# EAGLE design Mainsnode_v2_wifi_rev_a (EAGLE 6.3)
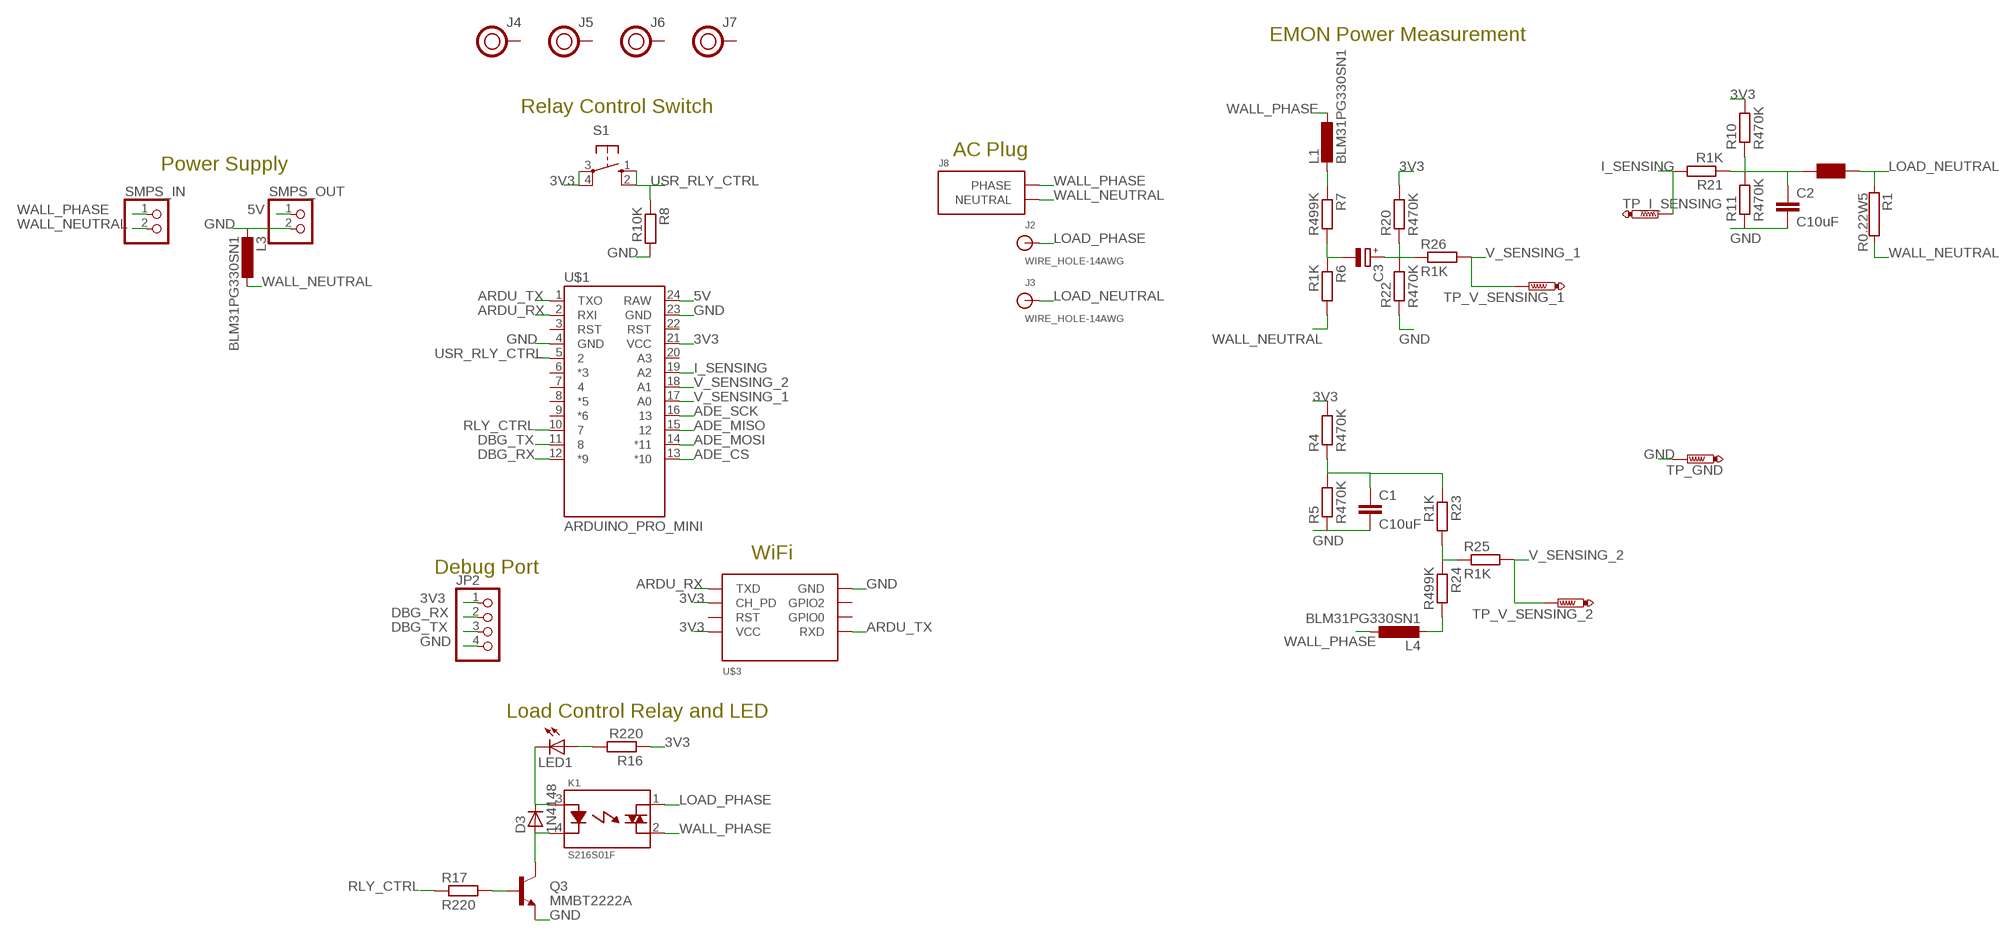
[diagram p0: schematic, sheet 1]

## Parts
C1  C10uF  C-EUC0805  [C0805]
C2  C10uF  C-EUC0805  [C0805]
C3  CPOL-EU140CLH-0810  [140CLH-0810]
D3  1N4148  D-SOD-80  [SOD80]
J2  WIRE_HOLE-14AWG  [WIRE_HOLE-14AWG]
J3  WIRE_HOLE-14AWG  [WIRE_HOLE-14AWG]
J4  HOLE  [HOLE-0.125]
J5  HOLE  [HOLE-0.125]
J6  HOLE  [HOLE-0.125]
J7  HOLE  [HOLE-0.125]
J8  AC-PLUG-2  [AC_MALE_PINS_2]
JP2  PINHD-1X4  [1X04]
K1  S216S01F  [RELAY_SX16S0X]
L1  BLM31PG330SN1  L-EUL3216C  [L3216C]
L3  BLM31PG330SN1  L-EUL3216C  [L3216C]
L4  BLM31PG330SN1  L-EUL3216C  [L3216C]
LED1  LED3MM  [LED3MM]
Q3  MMBT2222A  TRANSISTOR_NPNMMBT2222A  [SOT23-3]
R1  R0.22W5  RKH206-8  [KH206-8]
R4  R470K  R-EU_R0805  [R0805]
R5  R470K  R-EU_R0805  [R0805]
R6  R1K  R-EU_R0805  [R0805]
R7  R499K  R-EU_R0805  [R0805]
R8  R10K  R-EU_R0805  [R0805]
R10  R470K  R-EU_R0805  [R0805]
R11  R470K  R-EU_R0805  [R0805]
R16  R220  R-EU_R0805  [R0805]
R17  R220  R-EU_R0805  [R0805]
R20  R470K  R-EU_R0805  [R0805]
R21  R1K  R-EU_R0805  [R0805]
R22  R470K  R-EU_R0805  [R0805]
R23  R1K  R-EU_R0805  [R0805]
R24  R499K  R-EU_R0805  [R0805]
R25  R1K  R-EU_R0805  [R0805]
R26  R1K  R-EU_R0805  [R0805]
S1  10-XX  [B3F-10XX]
SMPS_IN  PINHD-1X2  [1X02]
SMPS_OUT  PINHD-1X2  [1X02]
TP_GND  PTR1PAD1-13  [P1-13]
TP_I_SENSING  PTR1PAD1-13  [P1-13]
TP_V_SENSING_1  PTR1PAD1-13  [P1-13]
TP_V_SENSING_2  PTR1PAD1-13  [P1-13]
U$1  ARDUINO_PRO_MINI  [ARDUINO_PRO_MINI]
U$2  BLM18BB151SN1  L0603  [L0603]
U$3  ESP8266  [ESP8266]

## Nets
3V3: JP2.1 R4.2 R10.2 R16.1 R20.2 S1.3(P) S1.4(P1) U$1.21(VCC) U$3.CH_PD U$3.VCC
5V: SMPS_OUT.1 U$1.24(RAW)
ADE_CS: U$1.13(*10)
ADE_MISO: U$1.15
ADE_MOSI: U$1.14(*11)
ADE_SCK: U$1.16
ARDU_RX: U$1.2(RXI) U$3.TXD
ARDU_TX: U$1.1(TXO) U$3.RXD
DBG_RX: JP2.2 U$1.12(*9)
DBG_TX: JP2.3 U$1.11
GND: C1.2 C2.2 JP2.4 L3.2 Q3.2(E) R5.1 R8.2 R11.1 R22.1 SMPS_OUT.2 TP_GND.TP U$1.4(GND) U$1.23(GND) U$3.GND
I_SENSING: R21.2 TP_I_SENSING.TP U$1.19(A2)
LOAD_NEUTRAL: J3.P$1 R1.1 U$2.2
LOAD_PHASE: J2.P$1 K1.1
N$1: C3.- R6.1 R7.2
N$2: C3.+ R20.1 R22.2 R26.1
N$3: C2.1 R10.1 R11.2 R21.1 U$2.1
N$4: C1.1 R4.1 R5.2 R23.1
N$5: L1.2 R7.1
N$6: R23.2 R24.1 R25.1
N$8: LED1.A R16.2
N$13: L4.2 R24.2
N$16: D3.1(C) K1.3 LED1.K(C)
N$18: D3.2(A) K1.4 Q3.3(C)
N$19: Q3.1(B) R17.2
RLY_CTRL: R17.1 U$1.10
USR_RLY_CTRL: R8.1 S1.1(S) S1.2(S1) U$1.5
V_SENSING_1: R26.2 TP_V_SENSING_1.TP U$1.17(A0)
V_SENSING_2: R25.2 TP_V_SENSING_2.TP U$1.18(A1)
WALL_NEUTRAL: J8.WALL_NEUTRAL(NEUTRAL) L3.1 R1.2 R6.2 SMPS_IN.2
WALL_PHASE: J8.WALL_PHASE(PHASE) K1.2 L1.1 L4.1 SMPS_IN.1
Unconnected: J4.1 J5.1 J6.1 J7.1 U$1.3(RST) U$1.6(*3) U$1.7 U$1.8(*5) U$1.9(*6) U$1.20(A3) U$1.22(RST) U$3.GPIO0 U$3.GPIO2 U$3.RST

## Notes on the sheet
- EMON Power Measurement
- Relay Control Switch
- AC Plug
- Power Supply
- WiFi
- Debug Port
- Load Control Relay and LED

## Library data of the parts
C1 C2 = resistor:C-EU: CAPACITOR, European symbol
C3 = resistor:CPOL-EU: POLARIZED CAPACITOR, European symbol
D3 = semicon-smd-ipc:D-: DIODE unfilled
J2 J3 = powercube:WIRE_HOLE-14AWG: Solder point for 14AWG wire
J4-J7 = powercube:HOLE: 0.125" PCB Hole with ring
J8 = tigorcustom:AC-PLUG-2: For use with Bud Industries Box: 377-1709-ND
JP2 = pinhead:PINHD-1X4: PIN HEADER
K1 = powercube:S216S01F: RELAY SSR 240VAC 16A TRIAC 4-SIP; DIGIKEY: 425-2413-5-ND; MOUSER: 852-S216S01F; NEWARK: 14N9591
L1 L3 L4 = resistor:L-EU: INDUCTOR, European symbol
LED1 = adafruit:LED: LED OSRAM: - CHIPLED LG R971, LG N971, LY N971, LG Q971, LY Q971, LO R971, LY R971 LH N974, LH R974 LS Q976, LO Q976, LY Q976 LO Q996 - Hyper CHIPLED LW Q18S LB Q993, LB Q99A, LB R99A - SideLED LS A670, LO A670, LY A670, LG A670, LP A670 LB A673, LV A673, LT A673, LW A673 LH A674 LY A675 LS A676, LA A676, LO A676, LY A676, LW A676 LS A679, LY A679, LG A679 - Hyper Micro SIDELED® LS Y876, LA Y876, LO Y876, LY Y876 LT Y87S - SmartLED LW L88C, LW L88S LB L89C, LB L89S, LG L890 LS L89K, LO L89K, LY L89K LS L896, LA L896, LO L896, LY L896 - TOPLED LS T670, LO T670, LY T670, LG T670, LP T670 LSG T670, LSP T670, LSY T670, LOP T670, LYG T670 LG T671, LOG T671, LSG T671 LB T673, LV T673, LT T673, LW T673 LH T674 LS T676, LA T676, LO T676, LY T676, LB T676, LH T676, LSB T676, LW T676 LB T67C, LV T67C, LT T67C, LS T67K, LO T67K, LY T67K, LW E67C LS E67B, LA E67B, LO E67B, LY E67B, LB E67C, LV E67C, LT E67C LW T67C LS T679, LY T679, LG T679 LS T770, LO T770, LY T770, LG T770, LP T770 LB T773, LV T773, LT T773, LW T773 LH T774 LS E675, LA E675, LY E675, LS T675 LS T776, LA T776, LO T776, LY T776, LB T776 LHGB T686 LT T68C, LB T68C - Hyper Mini TOPLED® LB M676 - Mini TOPLED Santana® LG M470 LS M47K, LO M47K, LY M47K Source: http://www.osram.convergy.de/
Q3 = SparkFun-DiscreteSemi:TRANSISTOR_NPN: Generic NPN BJT MMBT2222A - TRANS-08049 (SOT-23, 1A 40V) MPSA42 - TRANS-09116 (SOT-23, 500mA 300V) MMBT5088LT1G - TRANS-11160 (SOT-23, 50 mA 30V) BC547 - COM-08928 <http://www.sparkfun.com/products/8928> (TO-92 45V 100mA) (1.Collector 2.Base 3.Emitter) 2N3904 - COM-00521 <http://www.sparkfun.com/products/521> (TO-92 40V 200mA) (1.Emitter 2.Base 3.Collector) P2N2222A - COM-12852 <http://www.sparkfun.com/products/12852> (TO-92 40V 600mA) (1.Collector 2.Base 3.Emitter); PROD_ID: TRANS-08049
R1 = resistor-power:R: Power Resitor; OC_FARNELL: unknown; OC_NEWARK: unknown
R4-R8 R10 R11 R16 R17 R20-R26 = resistor:R-EU_: RESISTOR, European symbol
S1 = switch-omron:10-XX: OMRON SWITCH; MPN: B3F-1000; OC_FARNELL: 176432; OC_NEWARK: 36M3542
SMPS_IN SMPS_OUT = pinhead:PINHD-1X2: PIN HEADER
TP_GND TP_I_SENSING TP_V_SENSING_1 TP_V_SENSING_2 = testpad:PTR1: TEST PIN
U$1 = tigorcustom:ARDUINO_PRO_MINI
U$2 = tigorcustom:L0603
U$3 = tigorcustom:ESP8266

## Board
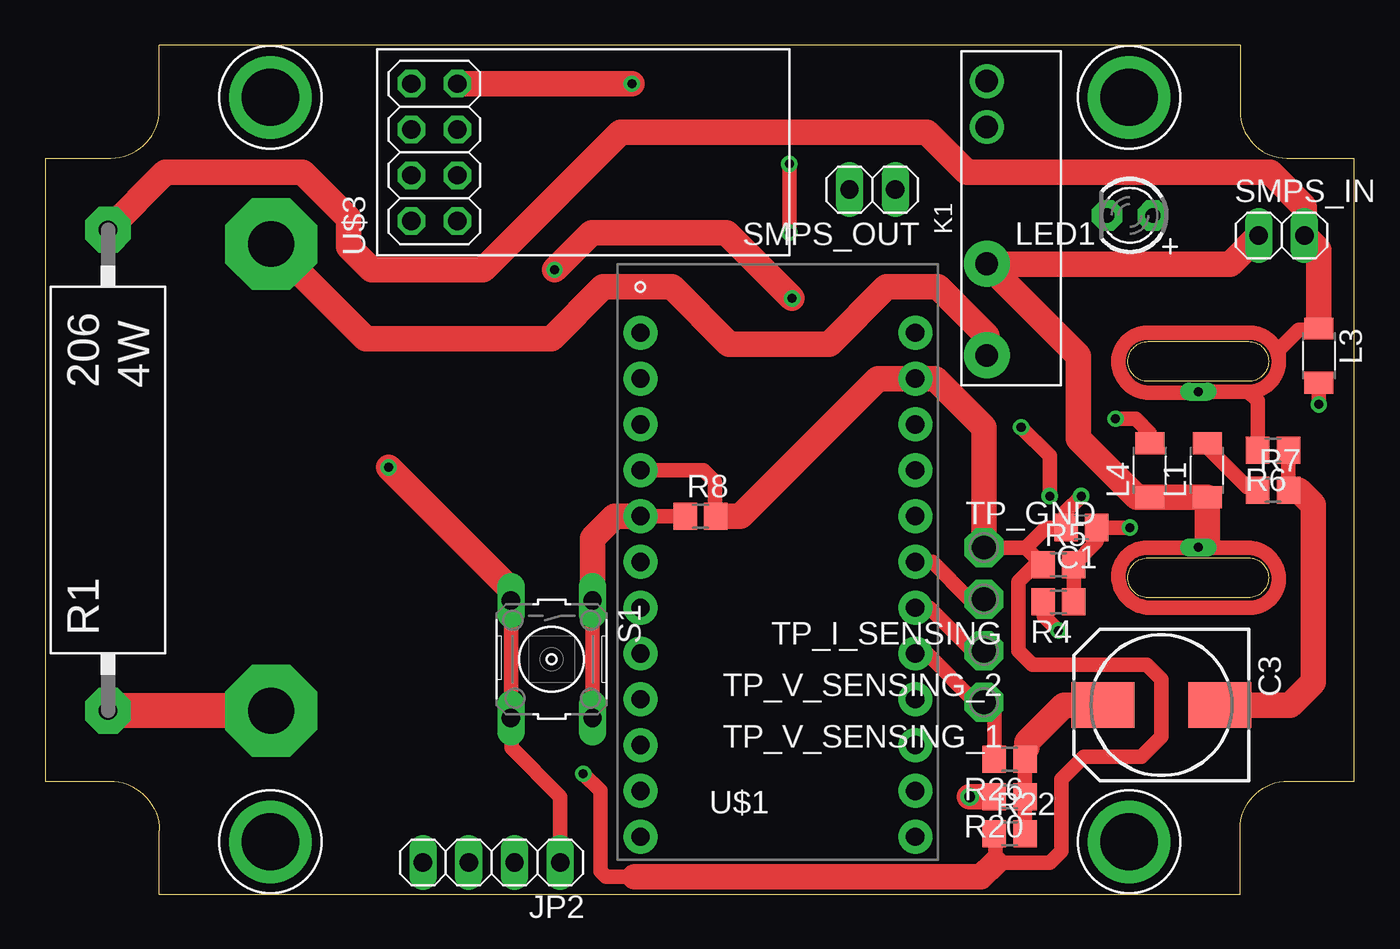
[diagram p1: board, top side]
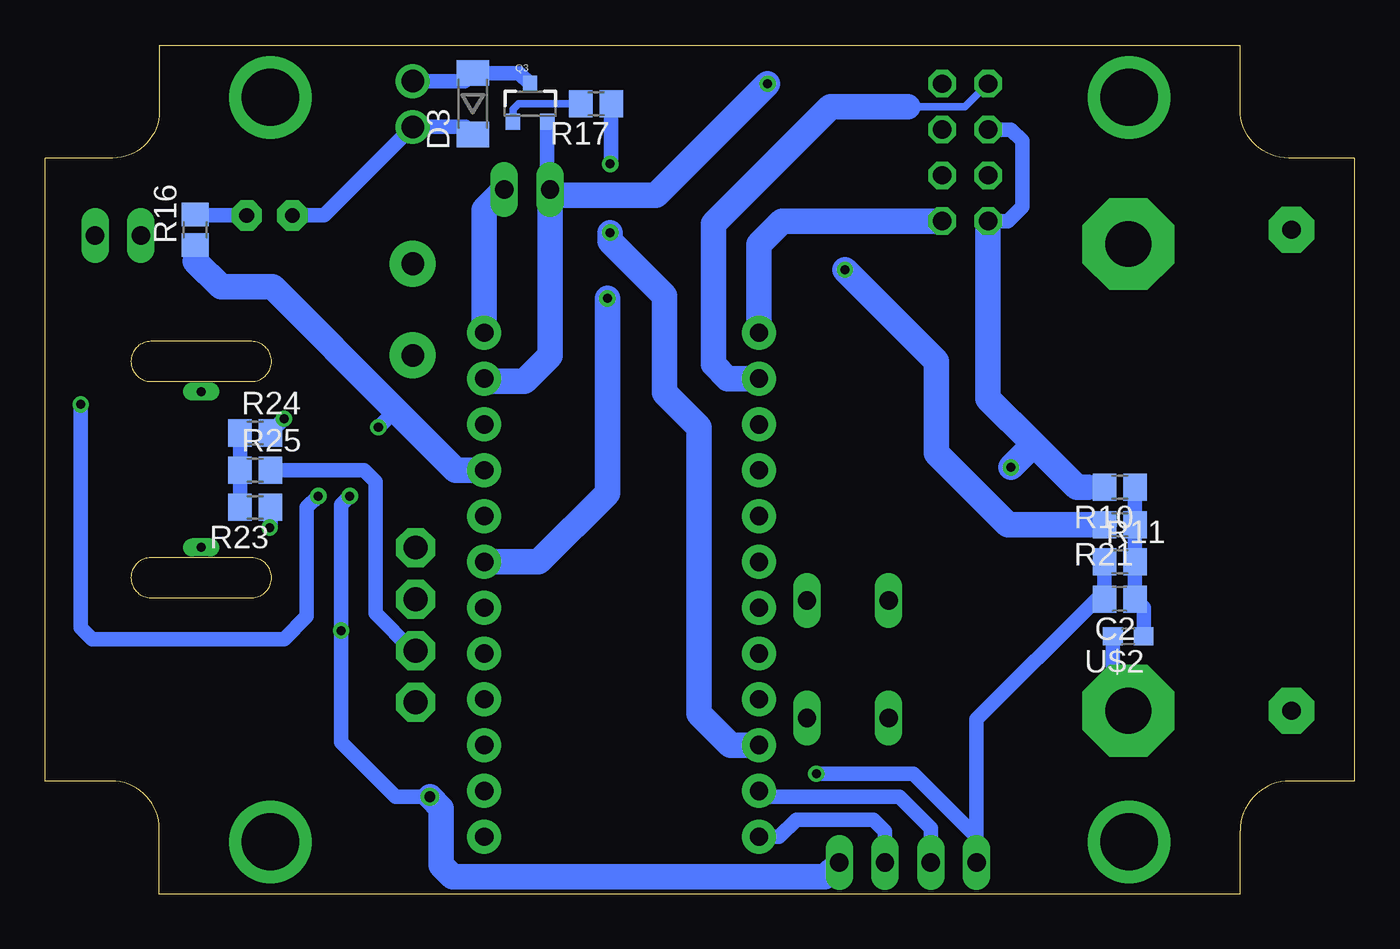
[diagram p2: board, bottom side, seen from below]

Size 72.62 x 47.07 mm. Coordinates in mm from the lower left corner, seen from the top.
Outline: 6.34,0 66.28,0 66.28,3.6 arc-90 68.94,6.26 72.62,6.26 72.62,40.8 68.87,40.8 arc-90 66.28,43.39 66.28,47.07 6.34,47.07 6.34,43.49 arc-90 3.65,40.8 0,40.8 0,6.26 3.58,6.26 arc-90 6.34,3.51 6.34,0
Copper layers (1*16): Top 0.035mm / dielectric 1.5mm / Bottom 0.035mm
Design rules "default": minimum track width 10mil, minimum drill 24mil, track to track 8mil, track to pad 8mil, pad to pad 8mil, via to via 8mil, smd to smd 8mil, copper to edge 40mil, drill to drill 8mil, minimum pad ring 10mil, minimum via ring 8mil, stop-mask expansion 4mil, vias tented up to drill 0mil, thermal gap 10mil

### Footprints (pad centres in the part's own frame; a part is rotated, then mirrored left to right if it is on the bottom)
C0805 = smd 1.3 x 1.5: 1 -0.85,0; 2 0.85,0
140CLH-0810 = smd 3.5 x 2.5: + 3.25,0; - -3.25,0
SOD80 = smd 1.4 x 1.8: 1 -1.7,0; 2 1.7,0
WIRE_HOLE-14AWG = drill 2.54 pad 5.08 octagon: P$1 0,0
HOLE-0.125 = drill 3.175 pad 4.572: 1 0,0
AC_MALE_PINS_2 = drill 0.5 pad 0.813 long: WALL_NEUTRAL 0,-4.318; WALL_PHASE 0,4.318
1X04 = drill 1.016 long: 1 -3.81,0; 2 -1.27,0; 3 1.27,0; 4 3.81,0
RELAY_SX16S0X = drill 1.25 pad 2.54: 1 -7.602,0; 2 -2.522,0 | drill 1.25: 3 5.062,0; 4 7.602,0
L3216C = smd 1.2 x 1.6: 1 -1.5,0; 2 1.5,0
LED3MM = drill 0.813 pad 1.676 octagon: A -1.27,0; K 1.27,0
SOT23-3 = smd 0.8 x 0.9: 1 -0.95,-1; 2 0.95,-1; 3 0,1.1
KH206-8 = drill 1.016 pad 2.54 octagon: 1 -13.335,0; 2 13.335,0
R0805 = smd 1.3 x 1.5: 1 -0.85,0; 2 0.85,0
B3F-10XX = drill 1.016 long: 1 -3.251,2.261; 2 3.251,2.261; 3 -3.251,-2.261; 4 3.251,-2.261
1X02 = drill 1.016 long: 1 -1.27,0; 2 1.27,0
P1-13 = drill 1.321 pad 2.159 octagon: TP 0,0
ARDUINO_PRO_MINI = drill 1.016 pad 1.88: 1 -7.62,12.7; 2 -7.62,10.16; 3 -7.62,7.62; 4 -7.62,5.08; 5 -7.62,2.54; 6 -7.62,0; 7 -7.62,-2.54; 8 -7.62,-5.08; 9 -7.62,-7.62; 10 -7.62,-10.16; 11 -7.62,-12.7; 12 -7.62,-15.24; 13 7.62,-15.24; 14 7.62,-12.7; 15 7.62,-10.16; 16 7.62,-7.62; 17 7.62,-5.08; 18 7.62,-2.54; 19 7.62,0; 20 7.62,2.54; 21 7.62,5.08; 22 7.62,7.62; 23 7.62,10.16; 24 7.62,12.7
L0603 = smd 1.1 x 1: 1 -0.85,0; 2 0.85,0
ESP8266 = drill 1.016 octagon: CH_PD 1.27,1.27; GND 3.81,-1.27; GPIO0 -1.27,-1.27; GPIO2 1.27,-1.27; RST -1.27,1.27; RXD -3.81,-1.27; TXD 3.81,1.27; VCC -3.81,1.27

### Placement (x,y rotation side)
C1  57.47,20.32 180 top
C2  13.02,16.35 180 bottom
C3  61.91,10.48 180 top
D3  48.9,43.81 90 bottom
J2  12.54,36.04 0 top
J3  12.54,10.16 0 top
J4  12.5,44.17 0 top
J5  60.12,44.17 0 top
J6  12.5,2.9 0 top
J7  60.12,2.9 0 top
J8  63.96,23.53 180 top
JP2  24.77,1.75 180 top
K1  52.23,37.47 90 top
L1  64.45,23.5 90 top
L3  70.64,29.84 270 top
L4  61.28,23.5 90 top
LED1  60.17,37.62 180 top
Q3  45.72,43.81 0 bottom
R1  3.49,23.5 90 top
R4  56.2,16.19 180 top
R5  56.2,18.26 0 top
R6  68.1,24.61 180 top
R7  68.1,22.38 0 top
R8  36.35,20.95 0 top
R10  13.02,22.54 180 bottom
R11  13.02,18.41 0 bottom
R16  64.29,36.83 90 bottom
R17  42.07,43.81 180 bottom
R20  53.5,5.4 180 top
R21  13.02,20.48 180 bottom
R22  53.5,3.33 0 top
R23  60.96,21.43 180 bottom
R24  60.96,25.56 0 bottom
R25  60.96,23.5 0 bottom
R26  53.5,7.46 180 top
S1  28.1,13.02 270 top
SMPS_IN  68.58,36.51 0 top
SMPS_OUT  45.88,39.05 180 top
TP_GND  52.07,19.21 0 top
TP_I_SENSING  52.07,16.35 180 top
TP_V_SENSING_1  52.07,10.64 180 top
TP_V_SENSING_2  52.07,13.49 180 top
U$1  40.64,18.41 0 top
U$2  12.54,14.29 180 bottom
U$3  21.59,41.12 90 top

### Tracks (layer width: path | path; a pad name or v marks a point on that pad's centre or on a via)
3V3  (via drill 0.5, 0.6)
  Top 0.813: 52.07,5.4 R20.2 | v55.72,22.07 55.72,24.29 v54.13,25.88 | R4.2 55.4,16.14 55.4,15.4 v56.2,14.61 | JP2.1 28.57,5.4 25.88,8.1 25.88,9.73 S1.4 S1.3
  Top 1.422: v51.28,5.4 52.07,5.4 | S1.3 25.84,16.87 v19.05,23.65
  Bottom 0.813: 64.29,35.08 R16.1 | v51.28,5.4 53.18,5.4 56.2,8.41 v56.2,14.61 56.2,21.59 v55.72,22.07 | v54.13,25.88 53.18,26.83 | U$3.CH_PD 19.05,42.39 18.41,41.75 18.41,38.1 19.21,37.31 U$3.VCC | R10.2 14.76,22.54
  Bottom 1.422: JP2.1 29.37,0.95 50.01,0.95 50.64,1.59 50.64,4.76 v51.28,5.4 | U$1.21 49.85,23.5 53.18,26.83 60.01,33.66 62.87,33.66 64.29,35.08 | 14.76,22.54 15.4,22.54 17.78,24.92 | 17.78,24.92 20.32,27.46 U$3.VCC | v19.05,23.65 17.78,24.92
5V
  Bottom 1.422: U$1.24 48.26,37.94 SMPS_OUT.1
ARDU_RX
  Bottom 0.406: U$3.TXD 21.59,43.66 24.77,43.66
  Bottom 1.422: 24.77,43.66 29.05,43.66 35.56,37.15 35.56,29.37 34.77,28.57 U$1.2
ARDU_TX
  Bottom 1.422: U$3.RXD 31.75,37.31 33.02,36.04 U$1.1
DBG_RX
  Bottom 0.813: U$1.12 31.91,3.17 30.96,4.13 26.67,4.13 26.04,3.49 JP2.2
DBG_TX
  Bottom 0.813: JP2.3 23.5,3.65 25.24,5.4 32.7,5.4 U$1.11
GND  (via drill 0.5)
  Top 0.813: TP_GND.TP 54.4,19.21 | 54.4,19.21 R5.1 54.93,18.26 53.98,17.3 53.98,13.49 54.77,12.7 61.12,12.7 61.91,11.91 61.91,8.73 60.8,7.62 57.63,7.62 56.36,6.35 56.36,2.38 55.72,1.75 52.7,1.75 52.7,3.28 R22.1 | 54.4,19.21 55.51,20.32 C1.2 56.62,21.22 v57.47,22.07 | v70.64,27.15 L3.2 | U$1.4 36.51,23.5 37.15,22.86 37.15,21.01 R8.2 37.78,20.95 | v29.84,6.67 30.8,5.71 30.8,1.27 31.11,0.95 32.7,0.95
  Top 1.422: TP_GND.TP 52.07,25.88 49.37,28.57 U$1.23 46.2,28.57 38.58,20.95 37.78,20.95 | 52.7,1.75 51.91,0.95 32.7,0.95 | U$3.GND v32.54,44.93
  Bottom 0.813: Q3.2 44.77,39.21 SMPS_OUT.2 | v70.64,27.15 70.64,14.76 70.01,14.13 59.37,14.13 58.1,15.4 58.1,21.43 v57.47,22.07 | v29.84,6.67 24.45,6.67 20.95,3.17 JP2.4 20.95,9.68 14.29,16.35 C2.2 R11.1
  Bottom 1.422: U$1.23 48.1,28.42 46.04,28.42 44.61,29.84 SMPS_OUT.2 44.29,38.73 38.73,38.73 v32.54,44.93
I_SENSING  (via drill 0.5)
  Top 0.813: U$1.19 49.21,18.41 51.28,16.35 TP_I_SENSING.TP
  Top 1.422: v28.26,34.61 30.32,36.67 37.78,36.67 v41.43,33.02
  Bottom 1.422: R21.2 19.21,20.48 23.18,24.45 23.18,29.53 v28.26,34.61 | v41.43,33.02 41.43,22.23 45.24,18.41 U$1.19
LOAD_NEUTRAL
  Top 1.93: J3.P$1 R1.1
  Bottom 0.813: U$2.2 13.39,11.01 J3.P$1
LOAD_PHASE
  Top 1.422: K1.1 52.23,30.96 49.53,33.66 46.67,33.66 43.5,30.48 37.94,30.48 34.77,33.66 30.96,33.66 28.1,30.8 17.78,30.8 J2.P$1
N$1
  Top 0.813: R6.1 R7.2 69.53,22.38
  Top 1.422: C3.- 69.06,10.48 70.33,11.75 70.33,21.59 69.53,22.38
N$2
  Top 0.813: R22.2 R20.1 R26.1 54.35,7.99 54.45,8.1
  Top 1.422: 54.45,8.1 54.45,8.41 56.52,10.48 C3.+
N$3
  Bottom 0.813: U$2.1 11.69,15.88 C2.1 R11.2 R21.1 R10.1
N$4  (via drill 0.5)
  Top 0.813: R4.1 R5.2 58.32,19.53 C1.1 v60.17,20.32
  Bottom 0.813: R23.1 60.11,20.38 v60.17,20.32
N$5
  Top 0.813: L1.2 64.45,24.77 66.67,22.54 67.09,22.54 R7.1
N$6
  Bottom 0.813: R24.1 R25.1 R23.2
N$8
  Bottom 0.813: LED1.A 64.24,37.62 R16.2
N$13  (via drill 0.5)
  Top 0.813: v59.37,26.35 60.48,26.35 61.28,25.56 L4.2
  Bottom 0.813: R24.2 60.11,25.61 v59.37,26.35
N$16
  Bottom 0.813: LED1.K 57.13,37.62 K1.3 49.31,42.53 D3.1
N$18
  Bottom 0.813: K1.4 49.34,45.07 D3.2 46.32,45.52 Q3.3
N$19
  Bottom 0.406: R17.2 46.35,43.81 46.67,43.5 Q3.1
RLY_CTRL  (via drill 0.5)
  Top 0.813: v41.27,40.48 v41.27,36.67
  Bottom 0.813: R17.1 41.22,40.54 v41.27,40.48
  Bottom 1.422: U$1.10 34.61,8.26 36.35,10 36.35,25.88 38.26,27.78 38.26,33.18 41.27,36.2 v41.27,36.67
USR_RLY_CTRL
  Top 0.813: U$1.5 R8.1 | S1.2 S1.1
  Top 1.422: S1.1 30.36,19.72 31.59,20.95 U$1.5
V_SENSING_1
  Top 0.813: U$1.17 48.9,13.34 51.59,10.64 TP_V_SENSING_1.TP 52.65,10.06 R26.2
V_SENSING_2
  Top 0.813: U$1.18 49.05,15.88 51.44,13.49 TP_V_SENSING_2.TP
  Bottom 0.813: TP_V_SENSING_2.TP 52.23,13.49 54.29,15.56 54.29,22.86 54.93,23.5 R25.2
WALL_NEUTRAL
  Top 0.813: J8.WALL_NEUTRAL 66.75,27.85 | 66.75,27.85 arc90 68.42,29.53 | 70.64,32.07 L3.1 70.57,31.27 69.53,31.27 68.42,30.16 68.42,29.53 | R6.2 67.25,27.34 66.75,27.85 | 68.42,29.53 arc90 66.83,31.11 61.12,31.11 arc90 59.53,29.53 arc90 61.28,27.78 64.14,27.78
  Top 1.422: R1.2 6.67,40.01 14.29,40.01 16.83,37.47 16.83,35.88 18.1,34.61 24.29,34.61 31.91,42.23 48.9,42.23 51.12,40.01 67.94,40.01 69.85,38.1 SMPS_IN.2 70.64,35.72 70.64,32.07
WALL_PHASE
  Top 0.813: 64.45,19.68 64.45,19.53 64.77,19.21 66.67,19.21 arc-90 68.42,17.46 arc-90 66.83,15.88 61.28,15.88 arc-90 59.53,17.62 arc-90 61.12,19.21 63.95,19.21 arc90 J8.WALL_PHASE J8.WALL_PHASE arc-90 63.98,19.21
  Top 1.422: 64.45,19.68 L1.1 L4.1 60.55,22 57.31,25.24 57.31,29.84 52.23,34.92 K1.2 52.25,34.92 65.72,34.92 SMPS_IN.1